# EAGLE design iobbq_solar_charger (EAGLE 7.2.0)
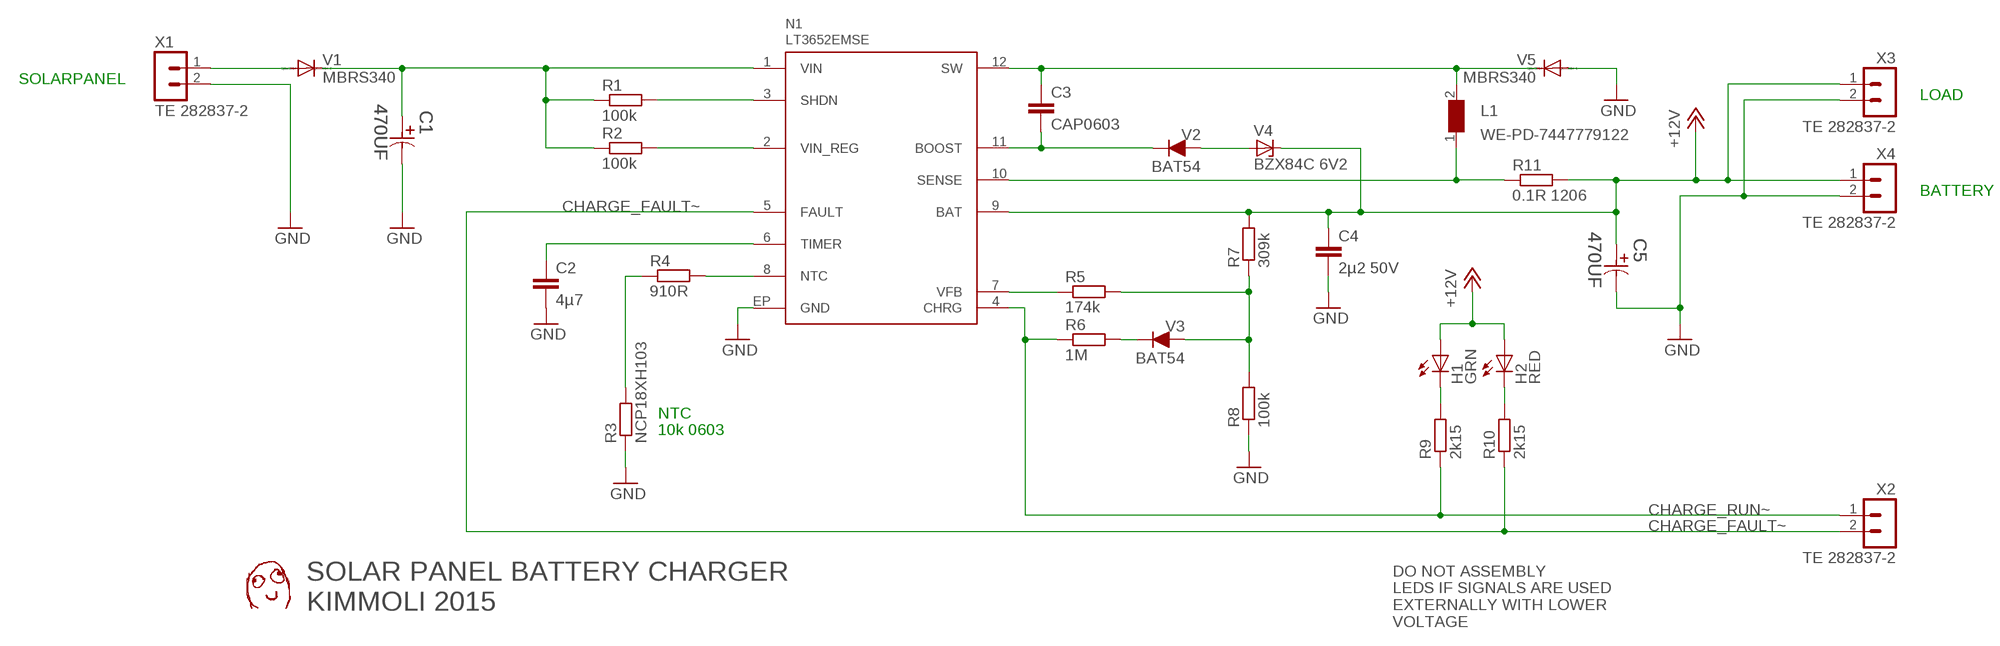
[diagram p0: schematic, sheet 1]

## Parts
C1  470UF  EEV-FK1V471Q-CASE-H13  [CAPAE1350X1400N]
C2  4µ7  CAP0805  [C0805]
C3  CAP0603  [C0603]
C4  2µ2 50V  CAP0805  [C0805]
C5  470UF  EEV-FK1V471Q-CASE-H13  [CAPAE1350X1400N]
H1  GRN  LED3MM  [LED3MM]
H2  RED  LED3MM  [LED3MM]
L1  WE-PD-7447779122  WE-PD-7447779122_7332/7345_PLASTIC_BASE  [WE-PD_7332/7345_PLASTIC_BASE]
N1  LT3652EMSE  [MSOP-12-EP-065]
R1  100k  RES0603  [R0603]
R2  100k  RES0603  [R0603]
R3  NCP18XH103  RES0603  [R0603]
R4  910R  RES0603  [R0603]
R5  174k  RES0603  [R0603]
R6  1M  RES0603  [R0603]
R7  309k  RES0603  [R0603]
R8  100k  RES0603  [R0603]
R9  2k15  RES1206  [R1206]
R10  2k15  RES1206  [R1206]
R11  0.1R 1206  RES1206  [R1206]
U$2  DAFUG  [DAFUG]
V1  MBRS340  DIODE-SMC  [SMC]
V2  BAT54  [SOT23]
V3  BAT54  [SOT23]
V4  BZX84C 6V2  BZX84CSMD  [TO236]
V5  MBRS340  DIODE-SMC  [SMC]
X1  TE 282837-2  TE_RUUVILIITIN2  [TE_RUUVILIITIN2]
X2  TE 282837-2  TE_RUUVILIITIN2  [TE_RUUVILIITIN2]
X3  TE 282837-2  TE_RUUVILIITIN2  [TE_RUUVILIITIN2]
X4  TE 282837-2  TE_RUUVILIITIN2  [TE_RUUVILIITIN2]

## Nets
+12V: C4.1 C5.1 H1.A H2.A N1.9(BAT) R7.2 R11.2 V4.C X3.1 X4.1
CHARGE_FAULT~: N1.5(FAULT) R10.1 X2.2
CHARGE_RUN~: N1.4(CHRG) R6.1 R9.1 X2.1
GND: C1.2 C2.2 C4.2 C5.2 N1.EP(GND) R3.1 R8.1 V5.A X1.2 X3.2 X4.2
N$1: H2.K(C) R10.2
N$2: H1.K(C) R9.2
N$49 [input]: V1.A X1.1
N$51 [input]: C1.1 N1.1(VIN) R1.1 R2.1 V1.C
N$52: N1.3(SHDN) R1.2
N$53: N1.2(VIN_REG) R2.2
N$54: C2.1 N1.6(TIMER)
N$55: C3.2 N1.11(BOOST) V2.3
N$56: C3.1 L1.2 N1.12(SW) V5.C
N$57: V2.1 V4.A
N$61: L1.1 N1.10(SENSE) R11.1
N$64: R3.2 R4.1
N$65: N1.8(NTC) R4.2
N$66: R5.2 R7.1 R8.2 V3.1
N$67: R6.2 V3.3
N$69: N1.7(VFB) R5.1

## Notes on the sheet
- SOLARPANEL
- LOAD
- BATTERY
- NTC
  10k 0603
- SOLAR PANEL BATTERY CHARGER
  KIMMOLI 2015
- DO NOT ASSEMBLY
  LEDS IF SIGNALS ARE USED
  EXTERNALLY WITH LOWER
  VOLTAGE

## Library data of the parts
C1 C5 = EKE:EEV-: Aluminum Electrolytic Capacitors,Surface Mount Type; MPN: EEVFK1V471Q; OC_FARNELL: 2282105; OC_NEWARK: 53W3911; SUPPLIER: PANASONIC; TOLERANCE: ±20 %; VOLTAGERATING: 35V
C2-C4 = OMAT_IC:CAP
H1 H2 = OMAT_IC:LED: LED OSRAM: - CHIPLED LG R971, LG N971, LY N971, LG Q971, LY Q971, LO R971, LY R971 LH N974, LH R974 LS Q976, LO Q976, LY Q976 LO Q996 - Hyper CHIPLED LW Q18S LB Q993, LB Q99A, LB R99A - SideLED LS A670, LO A670, LY A670, LG A670, LP A670 LB A673, LV A673, LT A673, LW A673 LH A674 LY A675 LS A676, LA A676, LO A676, LY A676, LW A676 LS A679, LY A679, LG A679 - Hyper Micro SIDELED® LS Y876, LA Y876, LO Y876, LY Y876 LT Y87S - SmartLED LW L88C, LW L88S LB L89C, LB L89S, LG L890 LS L89K, LO L89K, LY L89K LS L896, LA L896, LO L896, LY L896 - TOPLED LS T670, LO T670, LY T670, LG T670, LP T670 LSG T670, LSP T670, LSY T670, LOP T670, LYG T670 LG T671, LOG T671, LSG T671 LB T673, LV T673, LT T673, LW T673 LH T674 LS T676, LA T676, LO T676, LY T676, LB T676, LH T676, LSB T676, LW T676 LB T67C, LV T67C, LT T67C, LS T67K, LO T67K, LY T67K, LW E67C LS E67B, LA E67B, LO E67B, LY E67B, LB E67C, LV E67C, LT E67C LW T67C LS T679, LY T679, LG T679 LS T770, LO T770, LY T770, LG T770, LP T770 LB T773, LV T773, LT T773, LW T773 LH T774 LS E675, LA E675, LY E675, LS T675 LS T776, LA T776, LO T776, LY T776, LB T776 LHGB T686 LT T68C, LB T68C - Hyper Mini TOPLED® LB M676 - Mini TOPLED Santana® LG M470 LS M47K, LO M47K, LY M47K Source: http://www.osram.convergy.de LUXEON: - LUMILED® LXK2-PW12-R00, LXK2-PW12-S00, LXK2-PW14-U00, LXK2-PW14-V00 LXK2-PM12-R00, LXK2-PM12-S00, LXK2-PM14-U00 LXK2-PE12-Q00, LXK2-PE12-R00, LXK2-PE12-S00, LXK2-PE14-T00, LXK2-PE14-U00 LXK2-PB12-K00, LXK2-PB12-L00, LXK2-PB12-M00, LXK2-PB14-N00, LXK2-PB14-P00, LXK2-PB14-Q00 LXK2-PR12-L00, LXK2-PR12-M00, LXK2-PR14-Q00, LXK2-PR14-R00 LXK2-PD12-Q00, LXK2-PD12-R00, LXK2-PD12-S00 LXK2-PH12-R00, LXK2-PH12-S00 LXK2-PL12-P00, LXK2-PL12-Q00, LXK2-PL12-R00 Source: www.luxeon.com KINGBRIGHT: KA-3528ASYC Source: www.kingbright.com
L1 = WE-PD:WE-PD: SMD-Shielded Power Inductors WE-PD - Magnetically shielded version which results in a low leakage field - High storage capacity - Low self-losses - Highest possible current loading for SMD-Inducors -- Switching regulators with low operating voltages (computer, laptop, mobile phones, pagers) -- Integrated DC/DC-converter -- Is recommended for the application with switching regulators from National Semiconductor, Linear Technology, Texas Instruments and Fairchild Semiconductor, ect. -- Graphic cards -- Plastic base: Because of the one piece construction these are more suitable for high vibration or shock applications; MPN: 7447779122; OC_FARNELL: 1635991; OC_NEWARK: 08P2860; PACKAGE: 7345; SUPPLIER: Wuerth Elektronik
N1 = OMAT_IC:LT3652
R1-R11 = OMAT_IC:RES
U$2 = dafug:DAFUG
V1 V5 = diode:DIODE-: DIODE
V2 V3 = OMAT_IC:BAT54
V4 = diode:BZX84CSMD: Z DIODE
X1-X4 = OMAT_IC:TE_RUUVILIITIN2

## Net classes
1 input: clearance 0.25 mm

## Board
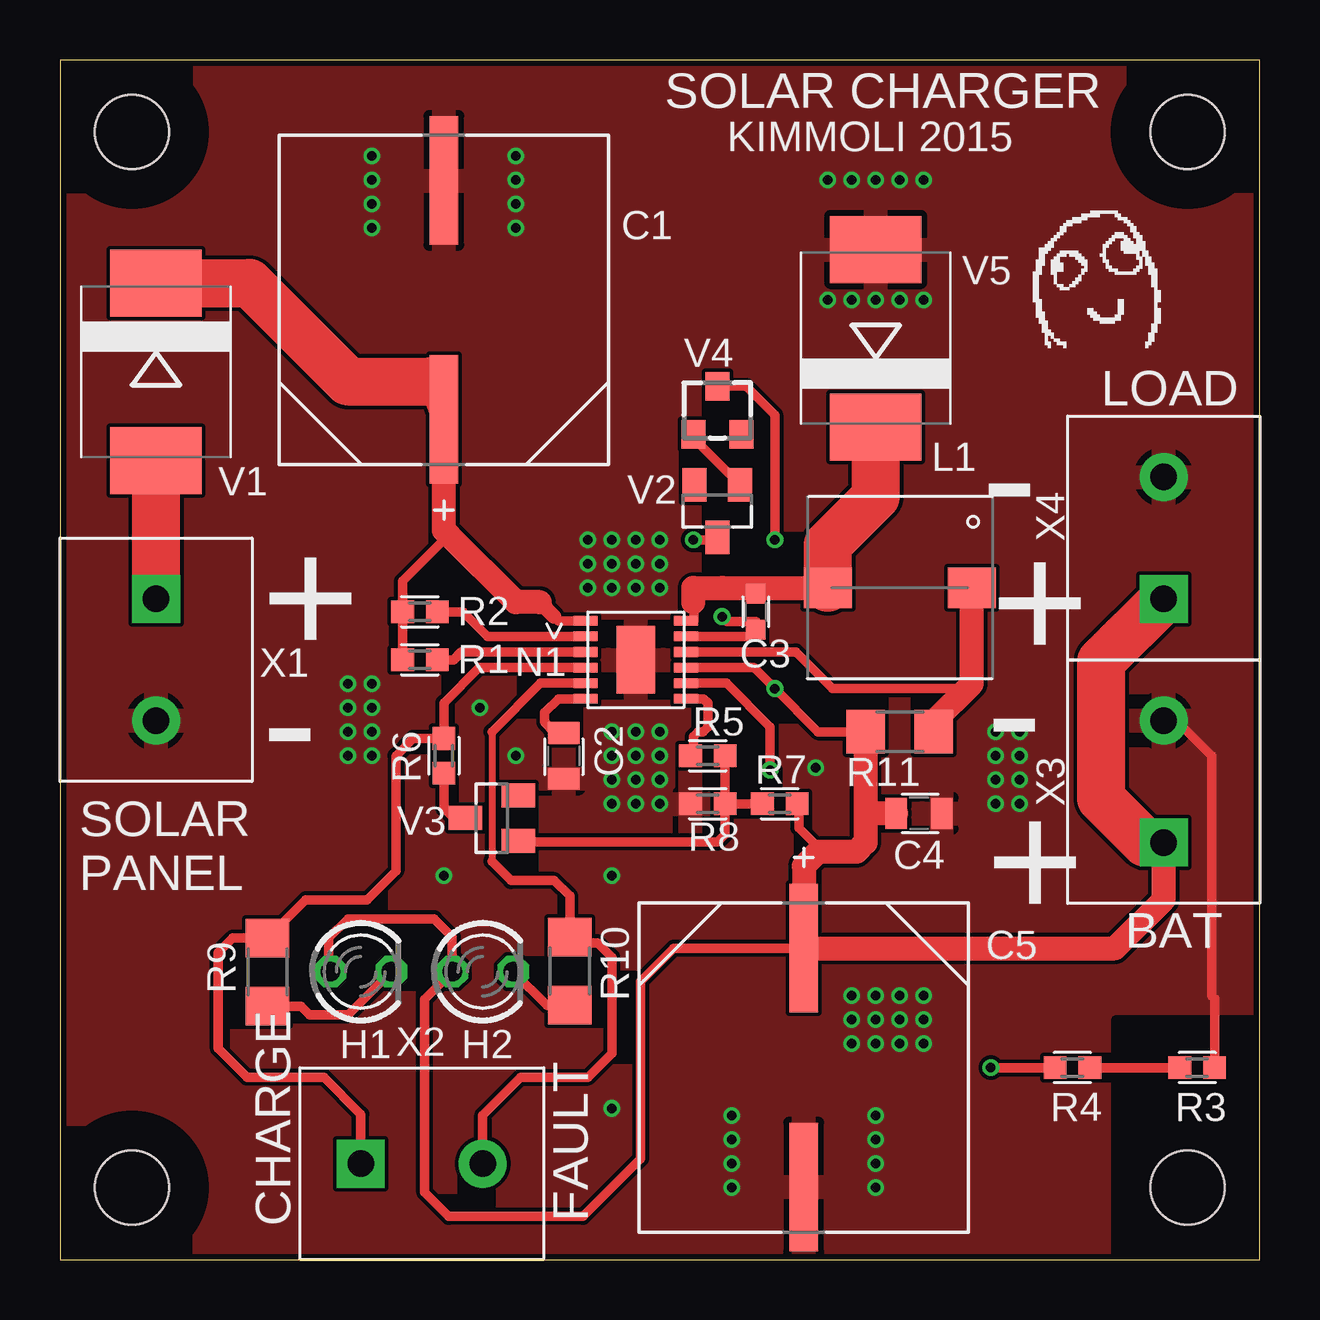
[diagram p1: board, top side]
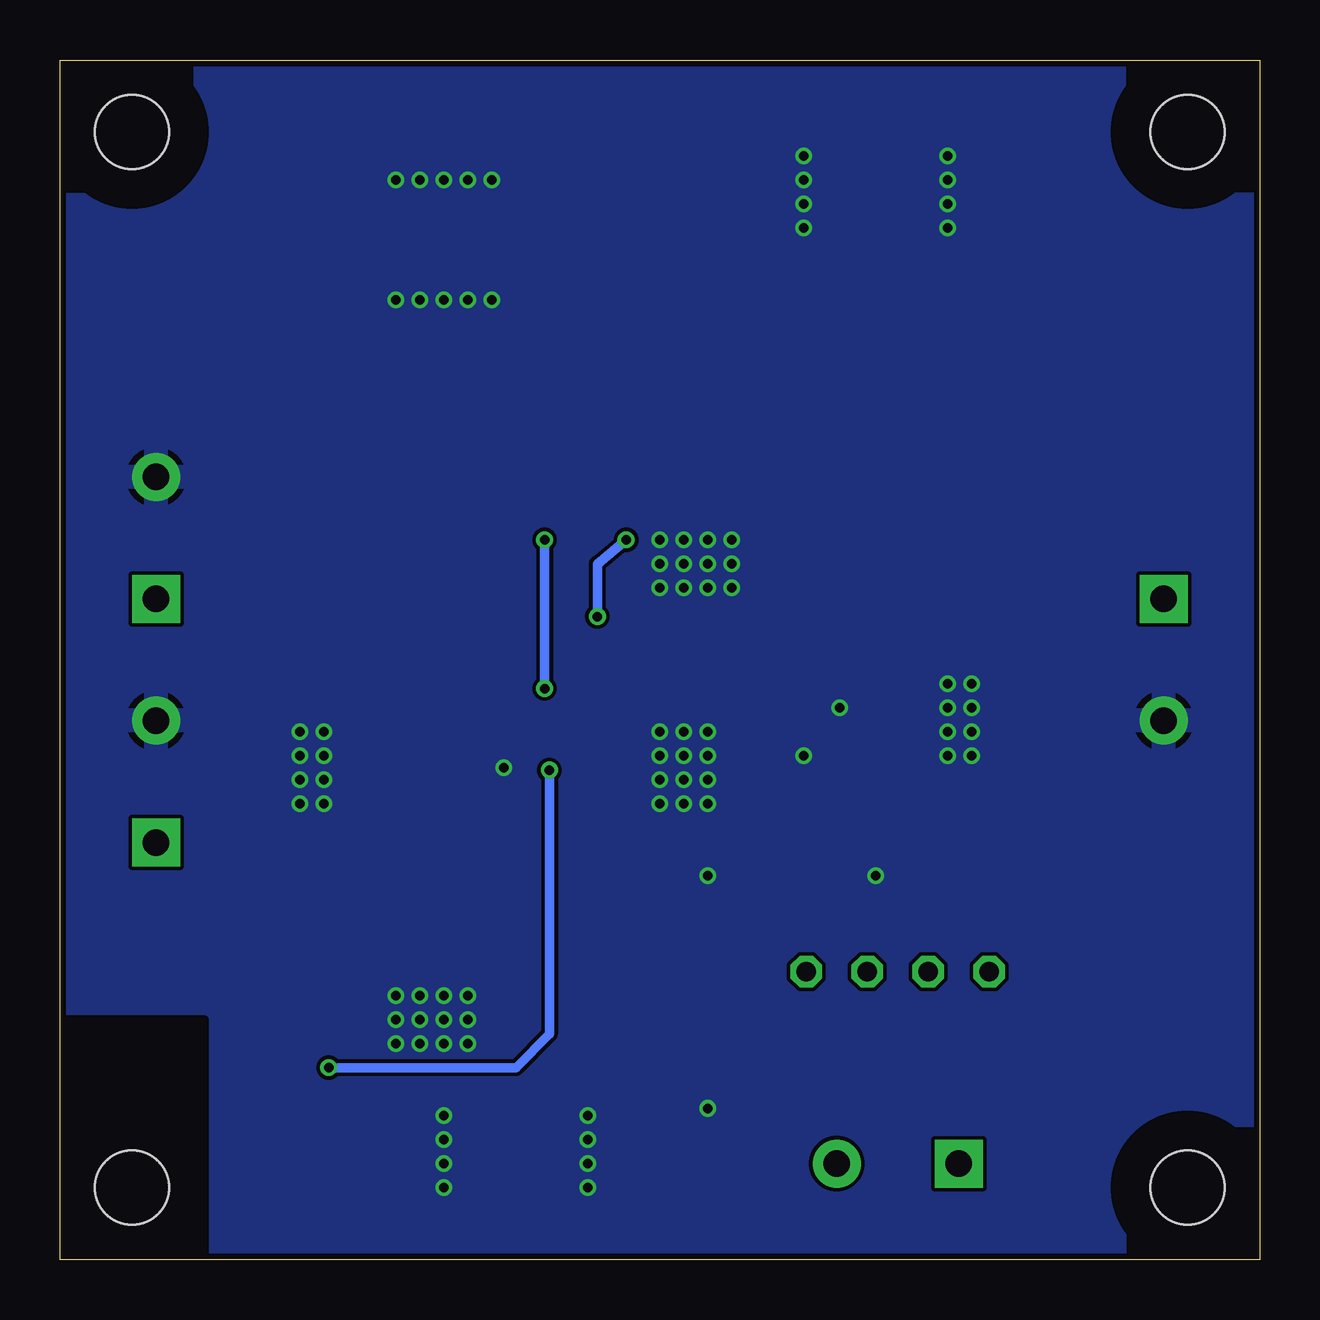
[diagram p2: board, bottom side, seen from below]

Size 50 x 50 mm. Coordinates in mm from the lower left corner, seen from the top.
Outline: 0,0 50,0 50,50 0,50 0,0
Copper layers (1*16): Top 0.035mm / dielectric 1.5mm / Bottom 0.035mm
Design rules "ITEADstudio_DRC": minimum track width 6mil, minimum drill 12mil, track to track 6mil, track to pad 6mil, pad to pad 6mil, via to via 6mil, smd to smd 0mil, copper to edge 10mil, drill to drill 10mil, minimum pad ring 10mil, minimum via ring 6mil, stop-mask expansion 2mil, vias tented up to drill 100mil, thermal gap 10mil
Holes 3.1 mm at 3,3 47,3 47,47 3,47
tRestrict: area 44,0 to 50,10; area 0,0 to 6,6; area 0,44 to 6,50; area 44,44 to 50,50
bRestrict: area 44,0 to 50,10; area 0,0 to 6,6; area 0,44 to 6,50; area 44,44 to 50,50

### Footprints (pad centres in the part's own frame; a part is rotated, then mirrored left to right if it is on the bottom)
CAPAE1350X1400N = smd 5.359 x 1.194: 1 -4.978,0; 2 4.978,0
C0805 = smd 0.9 x 1.3: 1 -0.95,0; 2 0.95,0
C0603 = smd 0.8 x 0.8: 1 -0.75,0; 2 0.75,0
LED3MM = drill 0.813 octagon: A -1.27,0; K 1.27,0
WE-PD_7332/7345_PLASTIC_BASE = smd 1.7 x 2: 1 0,3; 2 0,-3
MSOP-12-EP-065 = smd 1 x 0.4: 1 -2.1,1.625; 2 -2.1,0.975; 3 -2.1,0.325; 4 -2.1,-0.325; 5 -2.1,-0.975; 6 -2.1,-1.625; 7 2.1,-1.625; 8 2.1,-0.975; 9 2.1,-0.325; 10 2.1,0.325; 11 2.1,0.975; 12 2.1,1.625 | smd 1.6 x 2.8: EP 0,0
R0603 = smd 0.95 x 0.95: 1 -0.725,0; 2 0.725,0
R1206 = smd 1.6 x 1.803: 1 -1.422,0; 2 1.422,0
SMC = smd 2.8 x 3.8: A 3.7,0; C -3.7,0
SOT23 = smd 1 x 1.4: 1 -0.95,-1.1; 2 0.95,-1.1; 3 0,1.1
TO236 = smd 1 x 1.2: A -1,-1; C 0,1; NC 1,-1
TE_RUUVILIITIN2 = drill 1.1 pad 2 square: 1 0,0 | drill 1.1 pad 2: 2 5.08,0

### Placement (x,y rotation side)
C1  16,40 90 top
C2  21,21 270 top
C3  29,27 270 top
C4  35.8,18.6 0 top
C5  31,8 270 top
H1  12.54,12 0 top
H2  17.62,12 0 top
L1  35,28 270 top
N1  24,25 0 top
R1  15,25 0 top
R2  15,27 0 top
R3  47.4,8 180 top
R4  42.2,8 180 top
R5  27,21 0 top
R6  16,21 270 top
R7  30,19 0 top
R8  27,19 0 top
R9  8.65,11.98 270 top
R10  21.25,12.02 270 top
R11  35,22 180 top
U$2  43.4,40.6 0 top
V1  4,37 270 top
V2  27.4,31.2 180 top
V3  18,18.4 90 top
V4  27.4,35.4 0 top
V5  34,38.4 90 top
X1  4,27.54 270 top
X2  12.54,4 0 top
X3  46,17.38 90 top
X4  46,27.54 90 top

### Tracks (layer width: path | path; a pad name or v marks a point on that pad's centre or on a via)
+12V  (via drill 0.4)
  Top 0.4: 31.6,17 31.6,17.2 30.8,18 30.8,18.93 R7.2 | N1.9 28.93,24.68 v29.8,23.8 31.6,22 R11.2 | V4.C 28.6,36.4 29.8,35.2 v29.8,30 | C5.1 25.58,12.98 24.2,11.6 24.2,4.2 21.8,1.8 16.2,1.8 15.2,2.8 15.2,10.85 H2.A 16.35,13.45 15.6,14.2 12,14.2 11.2,13.4 11.2,12.07 H1.A
  Top 1: R11.2 33.58,18.4 | 33.58,18.4 33.58,17.38 33.2,17 31.6,17 31,16.4 C5.1 43.98,12.98 46,15 X3.1 45.22,17.38 | C4.1 33.78,18.6 33.58,18.4
  Top 2: 45.22,17.38 43.4,19.2 43.4,24.94 X4.1
  Bottom 0.4: v29.8,30 29.8,24 29.7,23.9 29.7,23.7 v29.8,23.8
CHARGE_FAULT~
  Top 0.3: 18,22 18,16.6
  Top 0.4: N1.5 20.02,24.02 18,22 | X2.2 17.62,6.02 19.2,7.6 22,7.6 23,8.6 23,12.6 22.4,13.2 21.49,13.2 R10.1 21.25,15.15 20.6,15.8 18.8,15.8 18,16.6
CHARGE_RUN~
  Top 0.4: N1.4 17.48,24.68 16,23.2 R6.1 14.72,21.73 14,21 14,16.2 12.8,15 10.25,15 R9.1 7.2,13.4 6.6,12.8 6.6,8.8 7.8,7.6 11,7.6 12.54,6.06 X2.1
GND  (via drill 0.4 pad 0.4)
  Top 0.4: R3.1 48.12,10.88 48,11 48,21 46,23
  other vias: 28,3 34,3 34,6 28,6 24,21 24,20 24,19 22,30 23,30 24,30 25,30 25,28 24,28 23,28 22,28 24,22 25,22 25,21 25,20 25,19 23,22 23,21 23,20 23,19 12,24 12,23 12,22 12,21 13,46 13,44 19,44 19,46 32,45 33,45 34,45 35,45 36,45 40,22 40,21 40,20 40,19 39,19 39,20 39,21 39,22 34,5 34,4 28,5 28,4 13,45 13,43 19,43 19,45 33,9 33,10 33,11 34,11 35,11 35,10 35,9 34,9 34,10 36,11 36,10 36,9 22,29 23,29 24,29 25,29 13,24 13,23 13,22 13,21 16,16 23,16 23,6.3 31.5,20.5 19,21 17.5,23 32,40 33,40 34,40 35,40 36,40
  pour Top: 0,0 50,0 50,50 0,50
  pour Bottom: 0,0 50,0 50,50 0,50
N$1
  Top 0.4: R10.2 20.29,10.6 H2.K
N$2
  Top 0.4: R9.2 10.04,10.56 10.4,10.2 12.01,10.2 H1.K
N$49
  Top 2: X1.1 V1.A
N$51
  Top 0.4: N1.1 20.77,26.62 20.6,26.8 | R1.1 R2.1 14.28,28.27 16.2,30.2
  Top 0.6: 20.6,26.8 20,27.4
  Top 1: 15.42,36.6 C1.1 16,30.4 16.2,30.2 19,27.4 20,27.4
  Top 2: V1.C 7.9,40.7 12,36.6 15.42,36.6
N$52
  Top 0.4: N1.3 16.73,25.32 16.4,25 R1.2
N$53
  Top 0.4: N1.2 17.82,25.98 16.8,27 R2.2
N$54
  Top 0.4: N1.6 20.77,23.38 20.2,22.8 20.2,22.4 20.6,22 20.95,22 C2.1
N$55  (via drill 0.4)
  Top 0.4: N1.11 28.73,25.98 C3.2 29,26.6 27.8,26.6 v27.6,26.8 | v26.4,30 27.5,30 V2.3
  Bottom 0.4: v27.6,26.8 27.6,29 v26.4,30
N$56
  Top 0.4: N1.12 26.43,26.62 26.4,27.4 | 27.6,28 28.75,28 C3.1
  Top 1: 26.4,27.4 26.4,28 27.6,28 L1.2
  Top 2: L1.2 32,29.8 34,31.8 V5.C
N$57
  Top 0.4: V4.A 26.4,34.25 V2.1
N$61
  Top 0.4: N1.10 30.68,25.32 32.2,23.8 37.6,23.8 38,24.2
  Top 1: R11.1 36.42,22.42 38,24 38,24.2 L1.1
N$64
  Top 0.4: R4.1 R3.2
N$65  (via drill 0.4)
  Top 0.4: N1.8 27.77,24.02 29.6,22.2 v29.6,20.4 | v38.8,8 R4.2
  Bottom 0.4: v29.6,20.4 29.6,9.4 31,8 v38.8,8
N$66
  Top 0.4: R8.2 R7.1 | R5.2 R8.2 | R8.2 27.73,17.73 27.4,17.4 19.15,17.4 V3.1
N$67
  Top 0.4: V3.3 16.4,18.4 16,18.8 R6.2
N$69
  Top 0.4: N1.7 26.82,23.38 27,23.2 27,22.2 26.8,22 26.6,22 26.4,21.8 26.4,21.12 R5.1

### Text on the board
tPlace: SOLAR CHARGER | KIMMOLI 2015 | LOAD | - | + | + | - | - | SOLAR / PANEL | + | BAT | FAULT | CHARGE